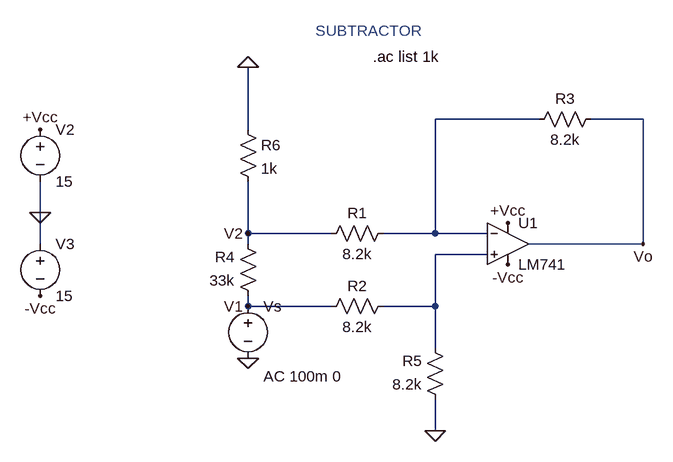
[diagram p0: schematic Subtractor.asc]
Subtractor.asc, the LTspice schematic file:
Version 4
SHEET 1 880 680
WIRE 384 -80 224 -80
WIRE 544 -80 464 -80
WIRE -64 -64 -64 -160
WIRE -384 64 -384 16
WIRE -64 96 -64 16
WIRE 64 96 -64 96
WIRE 224 96 224 -80
WIRE 224 96 144 96
WIRE 304 96 224 96
WIRE -384 112 -384 64
WIRE -64 112 -64 96
WIRE 544 112 544 -80
WIRE 544 112 368 112
WIRE 304 128 224 128
WIRE -64 208 -64 192
WIRE 64 208 -64 208
WIRE 224 208 224 128
WIRE 224 208 144 208
WIRE 224 272 224 208
WIRE 224 400 224 352
FLAG -64 -160 0
FLAG 224 400 0
FLAG -384 -64 +Vcc
FLAG -384 192 -Vcc
FLAG 336 80 +Vcc
FLAG 336 144 -Vcc
FLAG -384 64 0
FLAG -64 288 0
FLAG 544 112 Vo
FLAG -64 208 V1
FLAG -64 96 V2
SYMBOL Opamps\\LM741 336 48 R0
SYMATTR InstName U1
SYMATTR SpiceModel ""
SYMBOL res 160 80 R90
WINDOW 0 0 56 VBottom 2
WINDOW 3 32 56 VTop 2
SYMATTR InstName R1
SYMATTR Value 8.2k
SYMBOL res 160 192 R90
WINDOW 0 0 56 VBottom 2
WINDOW 3 32 56 VTop 2
SYMATTR InstName R2
SYMATTR Value 8.2k
SYMBOL res 480 -96 R90
WINDOW 0 0 56 VBottom 2
WINDOW 3 32 56 VTop 2
SYMATTR InstName R3
SYMATTR Value 8.2k
SYMBOL res -48 208 R180
WINDOW 0 36 76 Left 2
WINDOW 3 36 40 Left 2
SYMATTR InstName R4
SYMATTR Value 33k
SYMBOL res 240 368 R180
WINDOW 0 36 76 Left 2
WINDOW 3 36 40 Left 2
SYMATTR InstName R5
SYMATTR Value 8.2k
SYMBOL res -80 -80 R0
SYMATTR InstName R6
SYMATTR Value 1k
SYMBOL voltage -64 192 R0
WINDOW 123 24 124 Left 2
WINDOW 39 0 0 Left 2
SYMATTR InstName Vs
SYMATTR Value ""
SYMATTR Value2 AC 100m 0
SYMBOL voltage -384 -80 R0
SYMATTR InstName V2
SYMATTR Value 15
SYMBOL voltage -384 96 R0
SYMATTR InstName V3
SYMATTR Value 15
TEXT 128 -176 Left 2 !.ac list 1k
TEXT 40 -216 Left 2 ;SUBTRACTOR

The netlist it stands for:
* Subtractor.asc
XU1 N002 N001 +Vcc -Vcc Vo LM741  ; pins In+ In- V+ V- OUT
R1 N001 V2 8.2k
R2 N002 V1 8.2k
R3 Vo N001 8.2k
R4 V1 V2 33k
R5 0 N002 8.2k
R6 0 V2 1k
Vs V1 0 AC 100m 0
V2 +Vcc 0 15
V3 0 -Vcc 15
.ac list 1k
* SUBTRACTOR
.lib LM741.lib
.backanno
.end